# Altium schematic sheet USB Input.SchDoc
size A; SheetNumber: 4; SheetTotal: 14
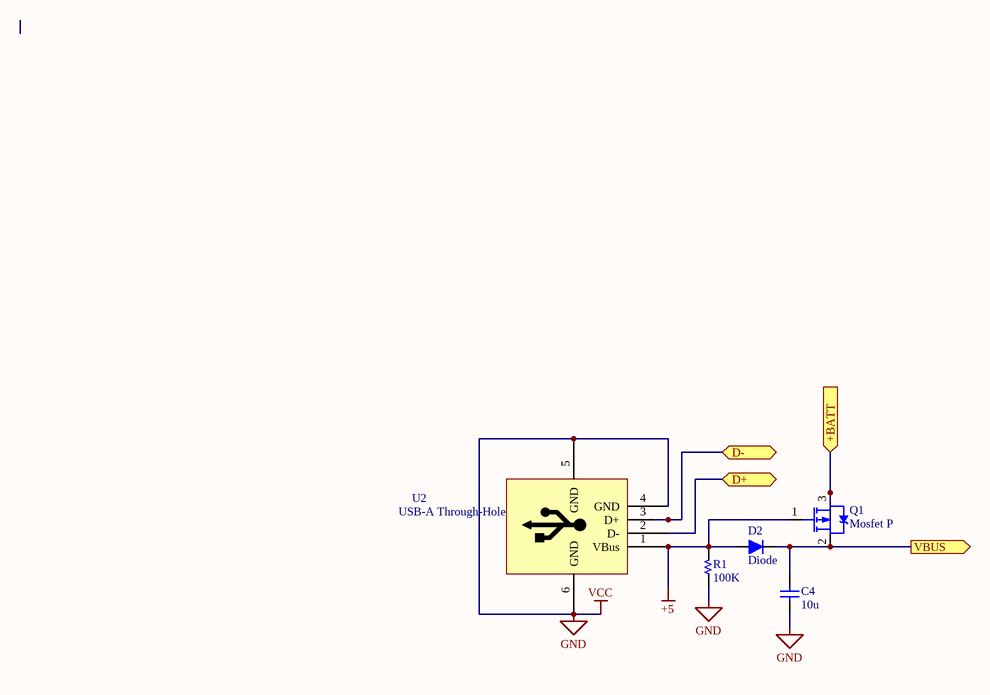
[diagram p0: USB Input.SchDoc]

## Parts
C4  10u  [C 0805]
D2  Diode  [DO-35 (SOD27 )]
Q1  Mosfet P  [SOT-23]
R1  100K  [R 0805]
U2  USB-A Through-Hole  [USB-A]

## Ports
+BATT (in, see ESP32[2A], Battery Charging[2B], Battery Voltaege Sense[2B]), D+ (bidir, see ESP32[2A], Programming Circuit[2B]), D- (bidir, see ESP32[2A], Programming Circuit[2B]), VBUS (out, see ESP32[3A], Battery Charging[3B], On-Off Switch[2A], Regulator 3.3V[1B])

## Nets
+5: D2.1(A) Q1.1(G) R1.2 U2.1(VBus)
GND: C4.2 R1.1 U2.4(GND) U2.5(GND) U2.6(GND)  [also labelled VCC]
+BATT: Q1.3(D) ; port +BATT
D+: U2.2(D-) ; port D+
D-: U2.3(D+) ; port D-
VBUS: C4.1 D2.2(K) Q1.2(S) ; port VBUS

## Library data of the parts
C4 = Capacitor NP: Capacitor non-pol
D2 = Diode: Default Diode
R1 = Resistor
U2 = USB-A TH